# Altium schematic sheet 4_Expansion.SchDoc
size A4; SheetNumber: 4; SheetTotal: 4
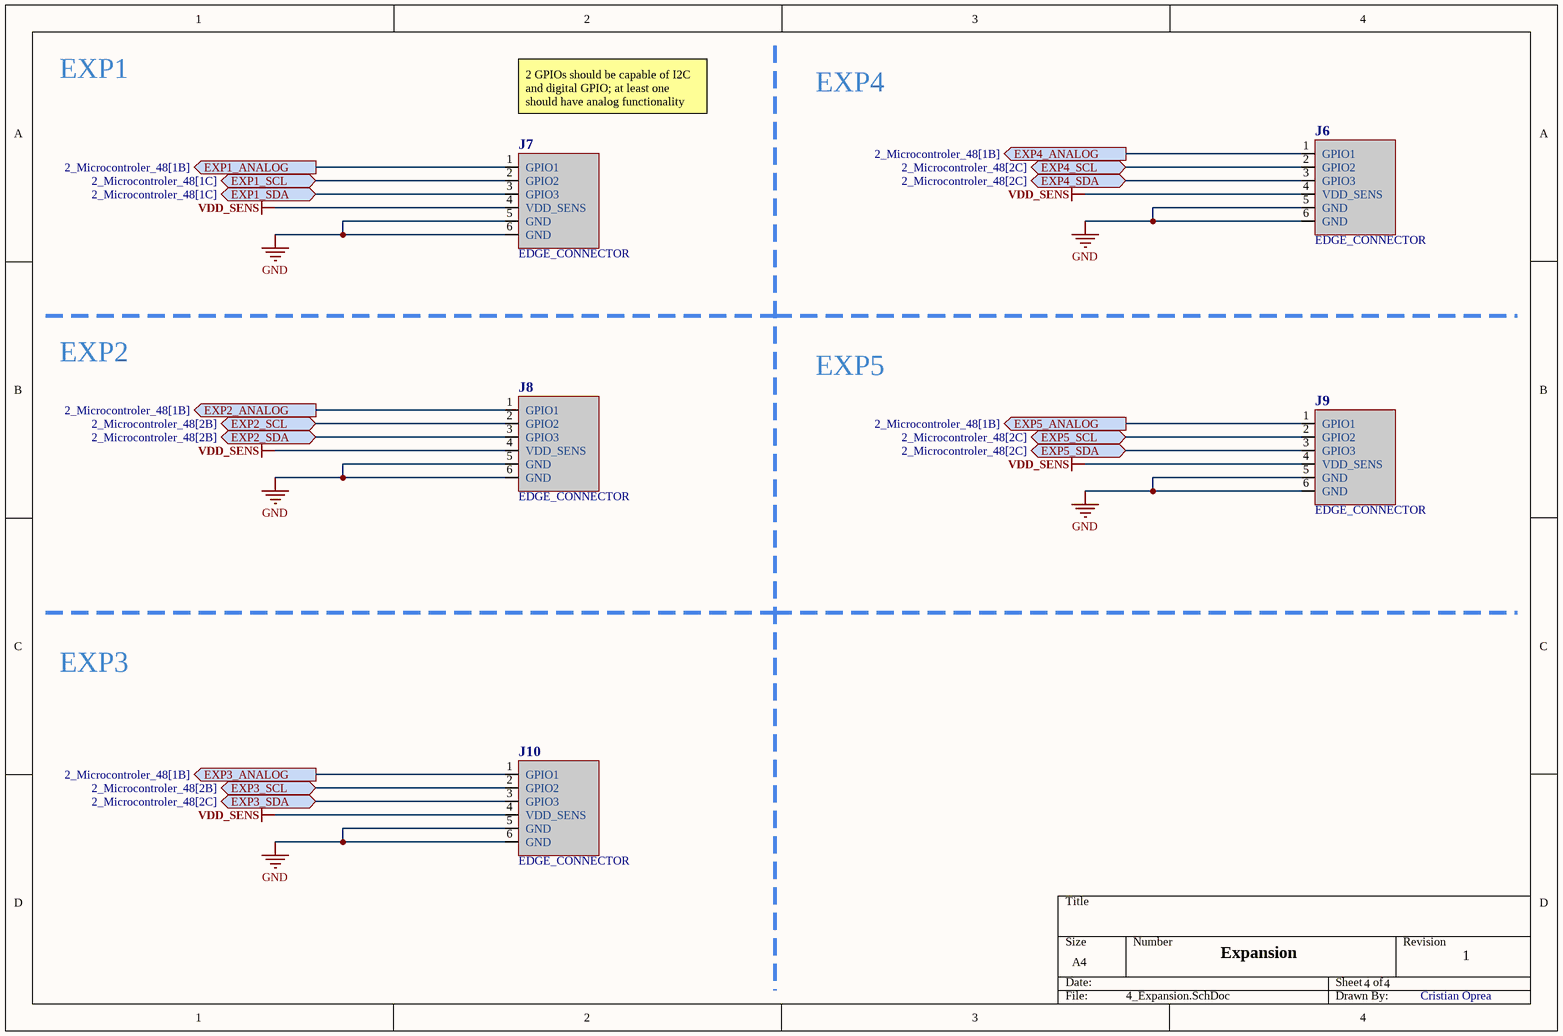
[diagram p0: 4_Expansion.SchDoc]

## Parts
J6  EDGE_CONNECTOR  [2.54mm_edge_connector]
J7  EDGE_CONNECTOR  [2.54mm_edge_connector]
J8  EDGE_CONNECTOR  [2.54mm_edge_connector]
J9  EDGE_CONNECTOR  [2.54mm_edge_connector]
J10  EDGE_CONNECTOR  [2.54mm_edge_connector]

## Ports
EXP1_ANALOG (out, see 2_Microcontroler_48[1B]), EXP1_SCL (bidir, see 2_Microcontroler_48[1C]), EXP1_SDA (bidir, see 2_Microcontroler_48[1C]), EXP2_ANALOG (out, see 2_Microcontroler_48[1B]), EXP2_SCL (bidir, see 2_Microcontroler_48[2B]), EXP2_SDA (bidir, see 2_Microcontroler_48[2B]), EXP3_ANALOG (out, see 2_Microcontroler_48[1B]), EXP3_SCL (bidir, see 2_Microcontroler_48[2B]), EXP3_SDA (bidir, see 2_Microcontroler_48[2C]), EXP4_ANALOG (out, see 2_Microcontroler_48[1B]), EXP4_SCL (bidir, see 2_Microcontroler_48[2C]), EXP4_SDA (bidir, see 2_Microcontroler_48[2C]), EXP5_ANALOG (out, see 2_Microcontroler_48[1B]), EXP5_SCL (bidir, see 2_Microcontroler_48[2C]), EXP5_SDA (bidir, see 2_Microcontroler_48[2C])

## Nets
GND: J6.5(GND) J6.6(GND) J7.5(GND) J7.6(GND) J8.5(GND) J8.6(GND) J9.5(GND) J9.6(GND) J10.5(GND) J10.6(GND)
VDD_SENS: J6.4(VDD_SENS) J7.4(VDD_SENS) J8.4(VDD_SENS) J9.4(VDD_SENS) J10.4(VDD_SENS)
EXP1_ANALOG: J7.1(GPIO1) ; port EXP1_ANALOG
EXP1_SCL: J7.2(GPIO2) ; port EXP1_SCL
EXP1_SDA: J7.3(GPIO3) ; port EXP1_SDA
EXP2_ANALOG: J8.1(GPIO1) ; port EXP2_ANALOG
EXP2_SCL: J8.2(GPIO2) ; port EXP2_SCL
EXP2_SDA: J8.3(GPIO3) ; port EXP2_SDA
EXP3_ANALOG: J10.1(GPIO1) ; port EXP3_ANALOG
EXP3_SCL: J10.2(GPIO2) ; port EXP3_SCL
EXP3_SDA: J10.3(GPIO3) ; port EXP3_SDA
EXP4_ANALOG: J6.1(GPIO1) ; port EXP4_ANALOG
EXP4_SCL: J6.2(GPIO2) ; port EXP4_SCL
EXP4_SDA: J6.3(GPIO3) ; port EXP4_SDA
EXP5_ANALOG: J9.1(GPIO1) ; port EXP5_ANALOG
EXP5_SCL: J9.2(GPIO2) ; port EXP5_SCL
EXP5_SDA: J9.3(GPIO3) ; port EXP5_SDA

## Notes on the sheet
- EXP1
- 2 GPIOs should be capable of I2C and digital GPIO; at least one should have analog functionality
- EXP4
- EXP2
- EXP5
- EXP3
- Expansion
- 4
- 1
- Cristian Oprea

## Library data of the parts
J6-J10 = edge_connector: Connector for sensor modules